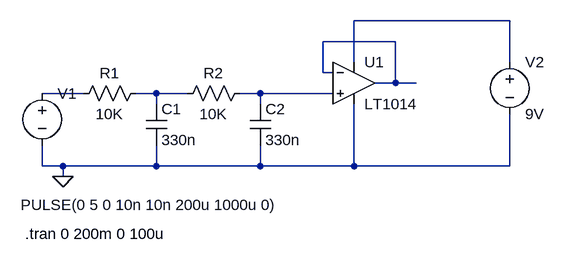
[diagram p0: schematic PWM Filter Simulation.asc]
PWM Filter Simulation.asc, the LTspice schematic file:
Version 4
SHEET 1 880 680
WIRE 640 80 400 80
WIRE 464 112 352 112
WIRE 400 144 400 80
WIRE 640 144 640 80
WIRE 352 160 352 112
WIRE 368 160 352 160
WIRE 464 176 464 112
WIRE 464 176 432 176
WIRE 496 176 464 176
WIRE -16 192 -80 192
WIRE 96 192 64 192
WIRE 144 192 96 192
WIRE 256 192 224 192
WIRE 368 192 256 192
WIRE 96 208 96 192
WIRE 256 208 256 192
WIRE -80 304 -80 272
WIRE -48 304 -80 304
WIRE 96 304 96 272
WIRE 96 304 -48 304
WIRE 256 304 256 272
WIRE 256 304 96 304
WIRE 400 304 400 208
WIRE 400 304 256 304
WIRE 640 304 640 224
WIRE 640 304 400 304
WIRE -48 320 -48 304
FLAG -48 320 0
SYMBOL res 80 176 R90
WINDOW 0 0 56 VBottom 2
WINDOW 3 32 56 VTop 2
SYMATTR InstName R1
SYMATTR Value 10K
SYMBOL cap 80 208 R0
SYMATTR InstName C1
SYMATTR Value 330n
SYMBOL voltage -80 176 R0
WINDOW 3 -33 188 Left 2
WINDOW 123 0 0 Left 2
WINDOW 39 0 0 Left 2
SYMATTR InstName V1
SYMATTR Value PULSE(0 5 0 10n 10n 200u 1000u 0)
SYMBOL Opamps\\LT1014 400 112 R0
SYMATTR InstName U1
SYMBOL voltage 640 128 R0
WINDOW 123 0 0 Left 2
WINDOW 39 0 0 Left 2
SYMATTR InstName V2
SYMATTR Value 9V
SYMBOL res 240 176 R90
WINDOW 0 0 56 VBottom 2
WINDOW 3 32 56 VTop 2
SYMATTR InstName R2
SYMATTR Value 10K
SYMBOL cap 240 208 R0
SYMATTR InstName C2
SYMATTR Value 330n
TEXT -106 408 Left 2 !.tran 0 200m 0 100u

The netlist it stands for:
* PWM Filter Simulation.asc
R1 N004 N003 10K
C1 N004 0 330n
V1 N003 0 PULSE(0 5 0 10n 10n 200u 1000u 0)
XU1 N005 N002 N001 0 N002 LT1014  ; pins In+ In- V+ V- OUT
V2 N001 0 9V
R2 N005 N004 10K
C2 N005 0 330n
.tran 0 200m 0 100u
.backanno
.end